# EAGLE design smart-relay (EAGLE 7.0.0)
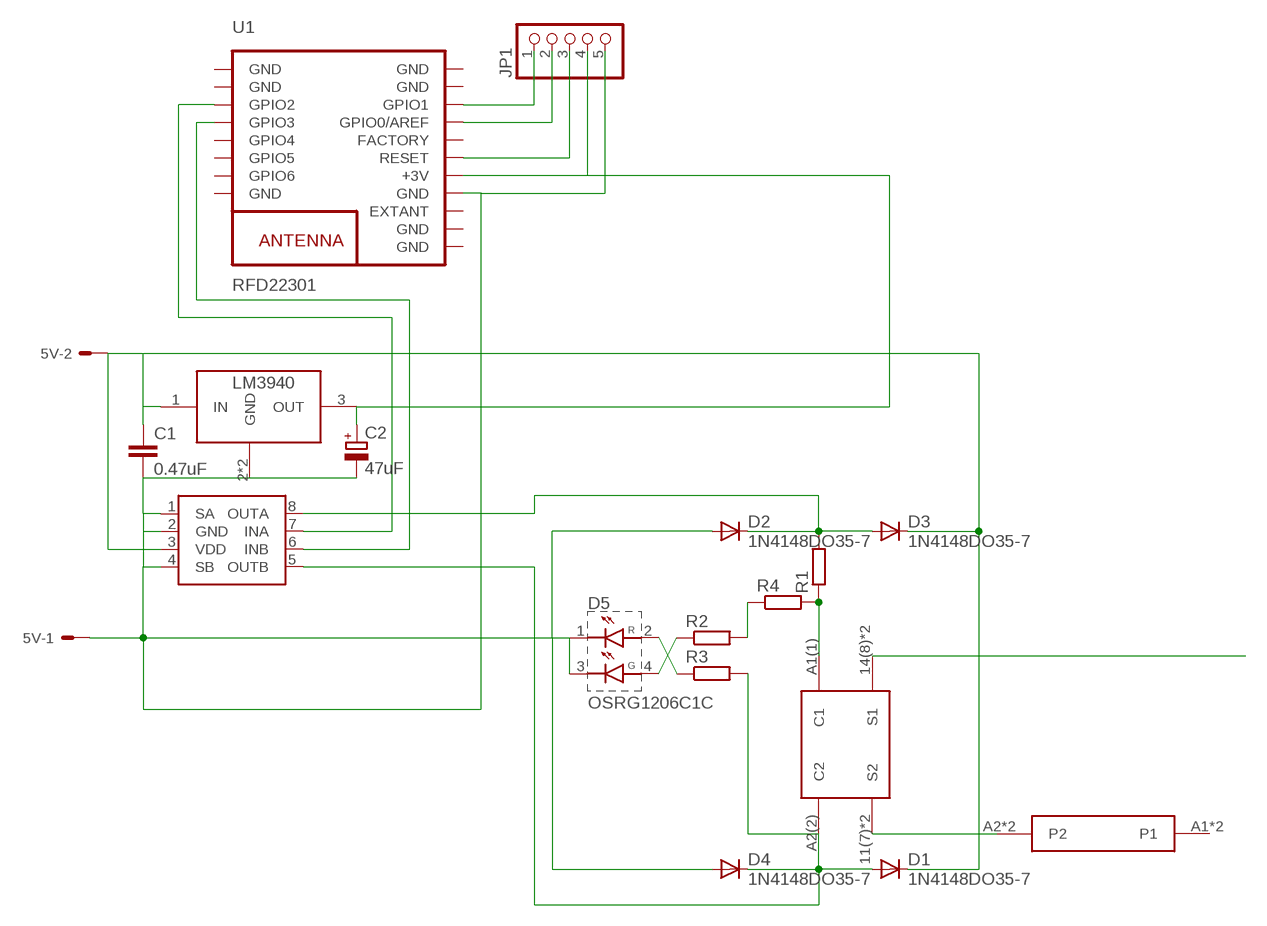
[diagram p0: schematic, sheet 1]

## Parts
5V  22-23-2021  [22-23-2021]
C1  0.47uF  CC3216  [C3216]
C2  47uF  CPOL-EUCT7343  [CT7343]
D1  1N4148DO35-7  [DO35-7]
D2  1N4148DO35-7  [DO35-7]
D3  1N4148DO35-7  [DO35-7]
D4  1N4148DO35-7  [DO35-7]
D5  OSRG1206C1C  [OSRG1206C1C]
FUSE  KEYSTONE3562  [KEYSTONE3562]
JP1  PINHD-1X5  [1X05]
LM3904  LDO3940  [SOT223]
R1  R-EU_0204/2V  [0204V]
R2  RR1206  [R1206]
R3  RR1206  [R1206]
R4  R-EU_0204/5  [0204/5]
U1  RFD22301  [RFD22301]
U$1  RMB851  [RMB581]
U$2  SI9986SO8  [SO-08]

## Nets
N$1: FUSE.A2(P2) FUSE.A2_(P2) U$1.11(7)(S2) U$1.21(4)(S2)
N$2: U$1.14(8)(S1) U$1.24(5)(S1)
N$3: JP1.1 U1.17(GPIO1)
N$4: U1.3(GPIO2) U$2.7(INA)
N$5: U1.4(GPIO3) U$2.6(INB)
N$6: 5V.2 C1.1 D1.C D3.C LM3904.1(IN) U$2.3(VDD)
N$7: 5V.1 C1.2 C2.- D2.A D4.A D5.1 D5.3 JP1.5 LM3904.2(GND) LM3904.4(GND) U1.12(GND) U$2.1(SA) U$2.2(GND) U$2.4(SB)
N$8: C2.+ JP1.4 LM3904.3(OUT) U1.13(+3V)
N$9: D2.C D3.A R1.2 U$2.8(OUTA)
N$10: D1.A D4.C R3.2 U$1.A2(2)(C2) U$2.5(OUTB)
N$11: JP1.2 U1.16(GPIO0/AREF)
N$12: JP1.3 U1.14(RESET)
N$13: R1.1 R4.2 U$1.A1(1)(C1)
N$14: R2.2 R4.1
N$15: D5.4 R2.1
N$16: D5.2 R3.1
Unconnected: FUSE.A1(P1) FUSE.A1_(P1) U1.5(GPIO4) U1.6(GPIO5) U1.7(GPIO6) U1.11(EXTANT) U1.15(FACTORY)

## Power pins joined to a net without a drawn wire
GND: U1.1(GND) U1.2(GND) U1.8(GND) U1.9(GND) U1.10(GND) U1.18(GND) U1.19(GND)

## Library data of the parts
5V = con-molex:22-23-2021: .100" (2.54mm) Center Header - 2 Pin; MF: MOLEX; MPN: 22-23-2021; OC_FARNELL: 1462926; OC_NEWARK: 25C3832
C1 = eagle-ltspice:C: CAPACITOR, European symbol; SPICEMODEL: NONE; SPICEPREFIX: C
C2 = rcl:CPOL-EU: POLARIZED CAPACITOR, European symbol
D1-D4 = diode:1N4148: DIODE high speed (Philips)
D5 = something:OSRG1206C1C
FUSE = keystone3562:KEYSTONE3562
JP1 = pinhead:PINHD-1X5: PIN HEADER
LM3904 = LM3940:LDO3940
R1 R4 = rcl:R-EU_: RESISTOR, European symbol
R2 R3 = eagle-ltspice:R: RESISTOR, European symbol; SPICEMODEL: NONE; SPICEPREFIX: R
U1 = RF_Digital_RFD22301_Eagle_Schematic_PCB_Library:RFD22301: RFD22301 RFduino SMT Module RFD22301 Datasheet: http://www.rfdigital.com/wp-content/uploads/2014/03/RFD22301.Data_.Sheet_.11.24.13_11.38PM.pdf
U$1 = rmb851:RMB851
U$2 = si9986:SI9986

## Board
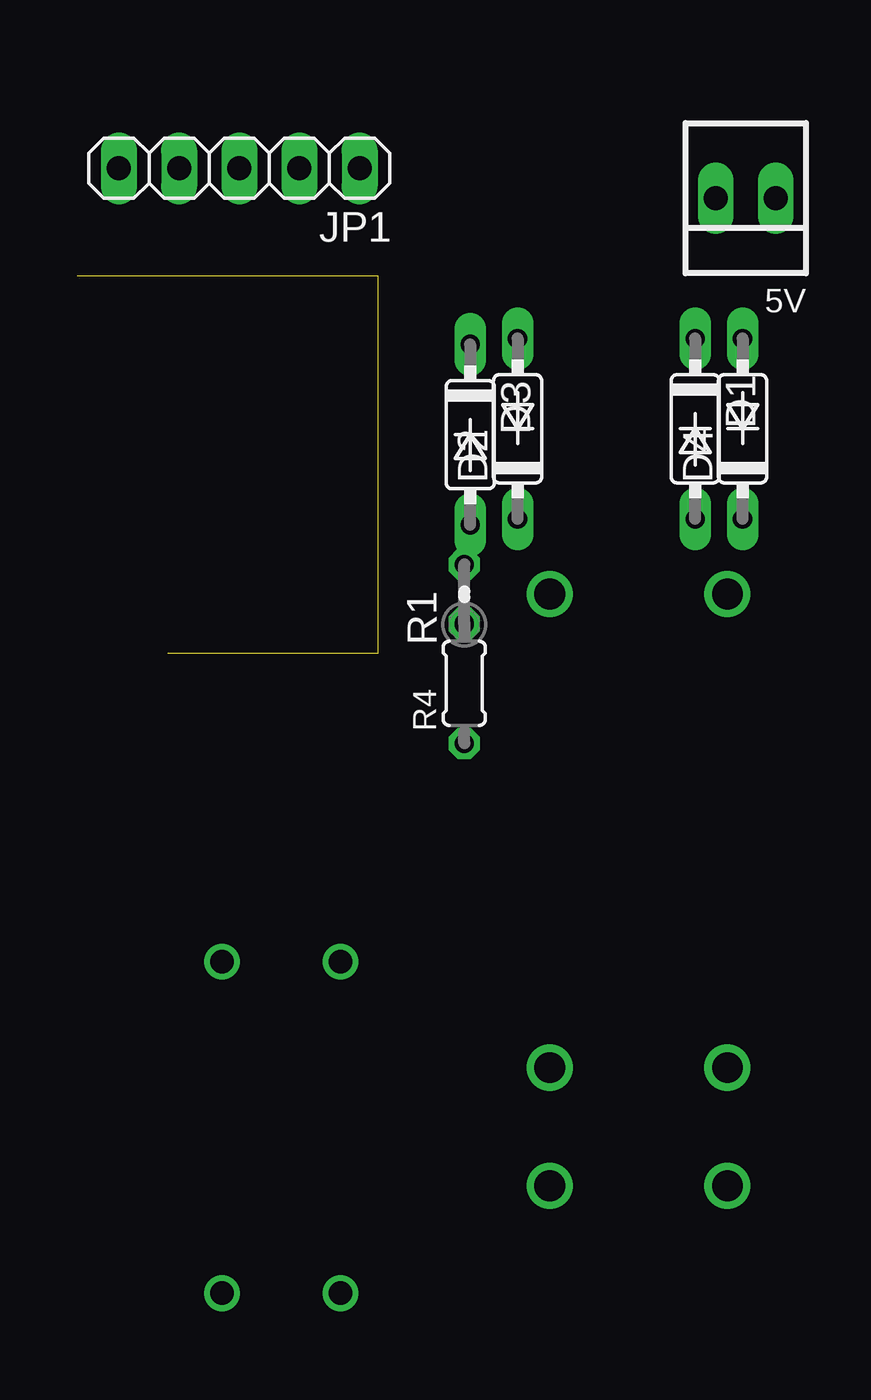
[diagram p1: board, top side]
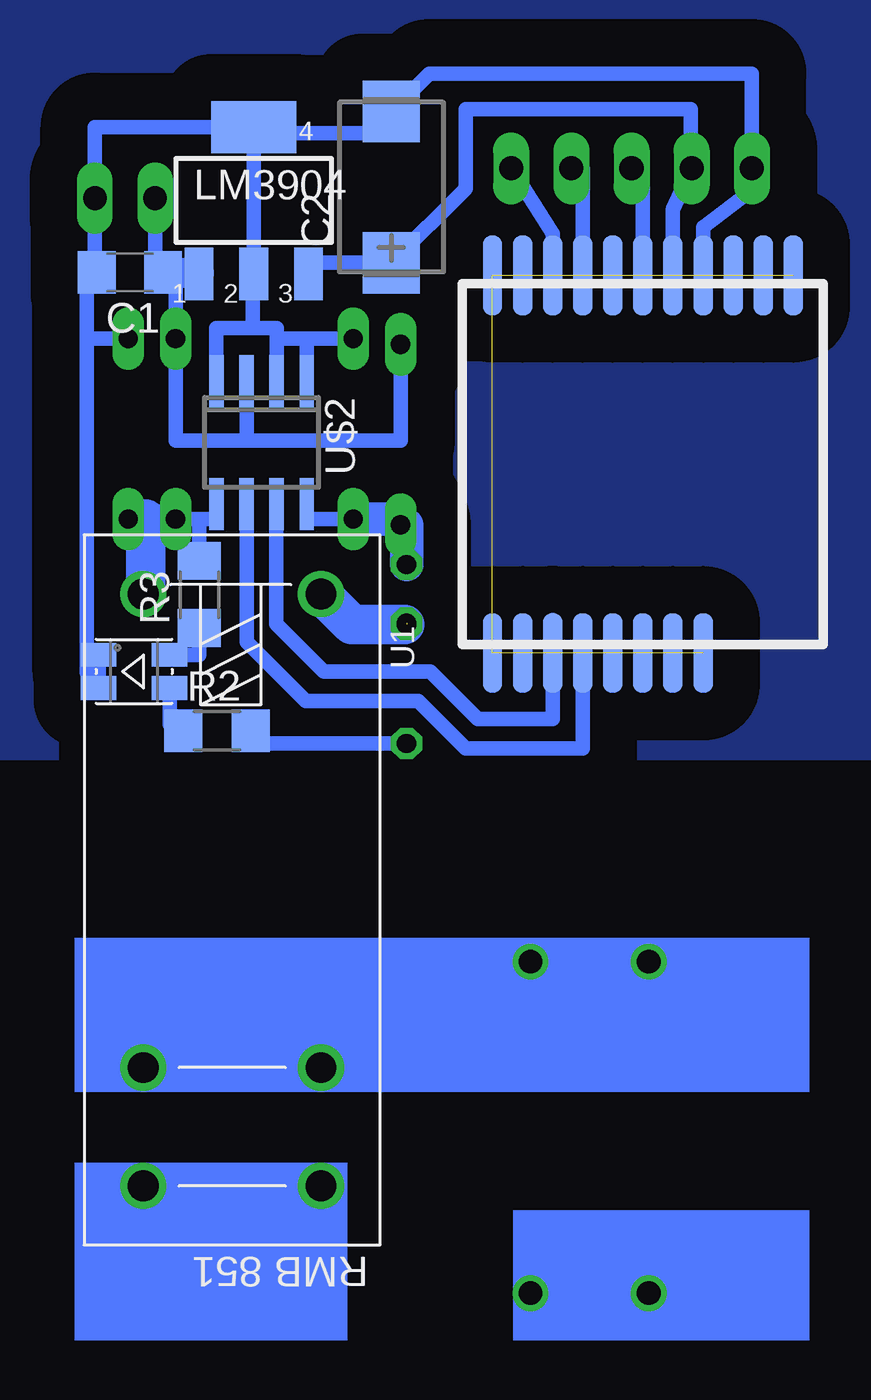
[diagram p2: board, bottom side, seen from below]

No outline drawn. Coordinates in mm, seen from the top.
Copper layers (1*16): Top 0.035mm / dielectric 1.5mm / Bottom 0.035mm
Design rules "default": minimum track width 10mil, minimum drill 24mil, track to track 8mil, track to pad 8mil, pad to pad 8mil, via to via 8mil, smd to smd 8mil, copper to edge 40mil, drill to drill 8mil, minimum pad ring 10mil, minimum via ring 8mil, stop-mask expansion 4mil, vias tented up to drill 0mil, thermal gap 10mil

### Footprints (pad centres in the part's own frame; a part is rotated, then mirrored left to right if it is on the bottom)
22-23-2021 = drill 1 long: 1 -1.27,0; 2 1.27,0
C3216 = smd 1.6 x 1.8: 1 -1.4,0; 2 1.4,0
CT7343 = smd 2.6 x 2.4: + -3.2,0; - 3.2,0
DO35-7 = drill 0.813 long: A 3.81,0; C -3.81,0
OSRG1206C1C = smd 1.5 x 1: 1 -1.5,0.7; 2 1.5,0.7; 3 -1.5,-0.7; 4 1.5,-0.7
KEYSTONE3562 = drill 1 pad 1.016: A1 0,0; A1_ 5,0; A2 0,-14; A2_ 5,-14
1X05 = drill 1.016 long: 1 -5.08,0; 2 -2.54,0; 3 0,0; 4 2.54,0; 5 5.08,0
SOT223 = smd 1.219 x 2.235: 1 -2.311,-3.099; 2 0,-3.099; 3 2.311,-3.099 | smd 3.6 x 2.2: 4 0,3.099
0204V = drill 0.813 octagon: 1 -1.27,0; 2 1.27,0
R1206 = smd 1.6 x 1.803: 1 -1.422,0; 2 1.422,0
0204/5 = drill 0.813 octagon: 1 -2.54,0; 2 2.54,0
RFD22301 = smd 3.353 x 0.813: 1 -7.976,7.62; 2 -7.976,6.35; 3 -7.976,5.08; 4 -7.976,3.81; 5 -7.976,2.54; 6 -7.976,1.27; 7 -7.976,0; 8 -7.976,-1.27; 9 7.976,-5.08; 10 7.976,-3.81; 11 7.976,-2.54; 12 7.976,-1.27; 13 7.976,0; 14 7.976,1.27; 15 7.976,2.54; 16 7.976,3.81; 17 7.976,5.08; 18 7.976,6.35; 19 7.976,7.62
RMB581 = drill 1.3 pad 1.422: 11(7) 0,-5; 14(8) 0,0; 21(4) 7.5,-5; 24(5) 7.5,0; A1(1) 0,-25; A2(2) 7.5,-25
SO-08 = smd 0.6 x 2.2: 1 -1.905,-2.6; 2 -0.635,-2.6; 3 0.635,-2.6; 4 1.905,-2.6; 5 1.905,2.6; 6 0.635,2.6; 7 -0.635,2.6; 8 -1.905,2.6

### Placement (x,y rotation side)
5V  28.89,52.24 180 top
C1  28.68,49.1 180 bottom
C2  17.64,52.71 90 bottom
D1  26.75,42.5 270 top
D2  19.25,42.5 90 top
D3  17.25,42.25 270 top
D4  28.75,42.5 90 top
D5  28.5,32.25 0 bottom
FUSE  11.77,5.99 180 top
JP1  7.5,53.5 180 top
LM3904  23.45,52.14 0 bottom
R1  17,35.5 90 top
R2  25,29.75 0 bottom
R3  25.75,35.5 90 bottom
R4  17,31.75 90 top
U1  5.75,41 90 bottom
U$1  20.61,10.52 180 bottom
U$2  23.12,41.92 180 bottom

### Tracks (layer width: path | path; a pad name or v marks a point on that pad's centre or on a via)
GND  (6 unrouted)
N$1
  Bottom 0.406: U$1.11(7) U$1.21(4)
  Bottom 0.61: U$1.21(4) 25.27,17.02 FUSE.A2_ FUSE.A2
N$2
  Bottom 0.61: U$1.24(5) U$1.14(8)
N$3
  Bottom 0.61: U1.17 10.83,50.75 JP1.1
N$4
  Bottom 0.61: 10.83,34.42 U1.3 10.83,30.25 14,30.25 16,32.25 20.5,32.25 22.5,34.25 22.5,39.3 U$2.7
N$5
  Bottom 0.61: 9.56,33.19 U1.4 9.56,29 14.5,29 16.5,31 21.25,31 23.75,33.5 U$2.6
N$6
  Bottom 0.61: U$2.3 23.75,42 | 23.75,42 17.25,42 D3.C | 23.75,42 26.75,42 D1.C 26.75,49 27.28,49 C1.1 27.61,49.1 5V.2
  Bottom 1.27: C1.1 25.76,49.1 LM3904.1
N$7
  Bottom 0.61: U1.12 4.48,51.02 2.42,52.58 JP1.5 2.42,57.5 16.05,57.5 C2.- arc90 18.56,54.99 23.45,54.99 LM3904.4 | LM3904.4 LM3904.2 23.5,48.79 23.5,46.75 | 23.45,54.91 LM3904.4 | D4.A 30.44,46.31 30.5,46.25 | D2.A 21.21,46.31 | 21.21,46.31 U$2.1 | 23.5,46.75 22.48,46.75 U$2.2 22.48,46.31 21.21,46.31 | 23.5,46.75 25.02,46.75 U$2.4 | LM3904.4 30.16,55.24 5V.1 30.16,49.1 C1.2 30.5,48.68 30.5,46.25 | D5.3 D5.1 30.5,32.2 30.5,46.25
N$8
  Bottom 0.61: C2.+ 17.64,49.29 | 17.64,48.79 C2.+ | LM3904.3 21.14,49.51 C2.+ | C2.+ 14.5,52.65 14.5,56 5,56 5,53.5 JP1.4 5.75,51.75 U1.13
N$9
  Bottom 0.61: D2.C 21.21,38.69 U$2.8
  Bottom 1.422: D2.C 17.25,38.69 D3.A 17,38.44 R1.2
N$10
  Bottom 0.61: U$2.5 25.02,38.69 25.75,38.69 | 25.75,38.69 D1.A | 25.75,38.69 R3.2
  Bottom 1.27: D4.C 28,38.69 D1.A
  Bottom 1.676: U$1.A2(2) 28,35.52 28,38.69
N$11
  Bottom 0.61: U1.16 9.56,53.5 JP1.2
N$12
  Bottom 0.61: U1.14 7.02,53.5 JP1.3
N$13  (1 unrouted)
  Bottom 1.422: 17.07,34.23 R1.1
  Bottom 1.676: 17.07,34.23 19.32,34.23 U$1.A1(1)
N$14
  Bottom 0.61: R4.1 23.58,29.21 R2.2
N$15
  Bottom 0.61: R2.1 27,30 D5.4
N$16
  Bottom 0.61: D5.2 25.75,32.95 R3.1
N$17
  pour Bottom (isolate 2): -4,62 35,62 35,29 -4,29
(copper drawn outside any net)
  shapes: Bottom area x4